# EAGLE schematic Maya - Leonardo 32U4 sch v36 (EAGLE 9.7.0)
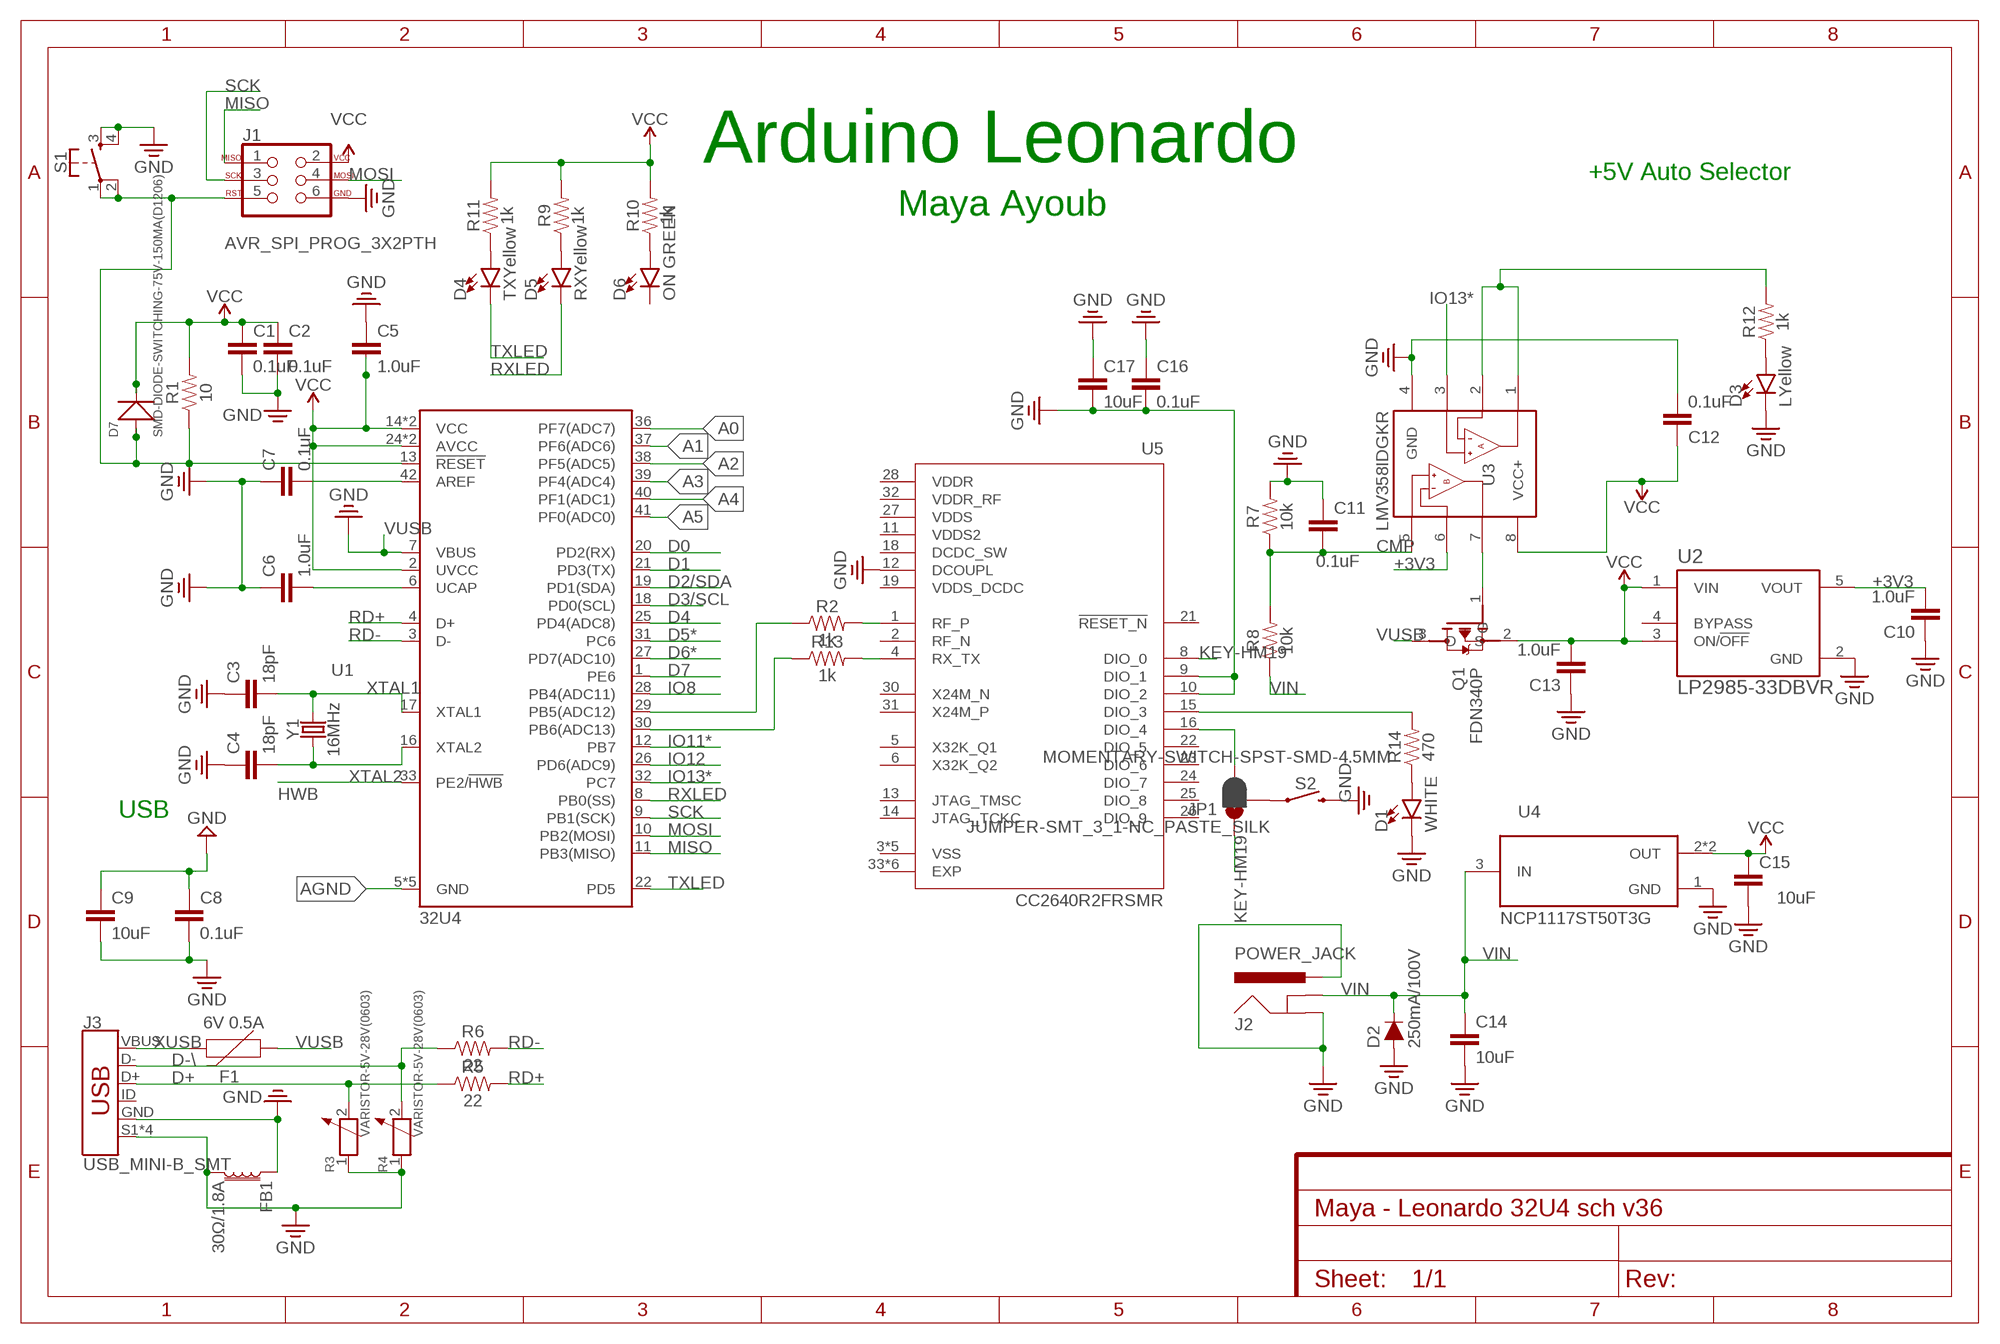
[diagram p0: schematic, sheet 1]

## Parts
C1  0.1uF  0.1UF-0603-25V-(+80/-20%)  [0603]
C2  0.1uF  0.1UF-0603-25V-(+80/-20%)  [0603]
C3  18pF  18PF-0603-50V-5%  [0603]
C4  18pF  18PF-0603-50V-5%  [0603]
C5  1.0uF  1.0UF-0805-25V-10%  [0805]
C6  1.0uF  1.0UF-0805-25V-(+80/-20%)  [0805]
C7  0.1uF  0.1UF-0603-25V-(+80/-20%)  [0603]
C8  0.1uF  0.1UF-0603-25V-(+80/-20%)  [0603]
C9  10uF  10UF-0603-6.3V-20%  [0603]
C10  1.0uF  1.0UF-0603-16V-10%  [0603]
C11  0.1uF  0.1UF-0603-25V-(+80/-20%)  [0603]
C12  0.1uF  0.1UF-0603-25V-(+80/-20%)  [0603]
C13  1.0uF  1.0UF-0603-16V-10%  [0603]
C14  10uF  10UF-0603-6.3V-20%  [0603]
C15  10uF  10UF-0603-6.3V-20%  [0603]
C16  0.1uF  0.1UF-0603-25V-(+80/-20%)  [0603]
C17  10uF  10UF-0603-6.3V-20%  [0603]
D1  WHITE  LED-WHITE0603  [LED-0603]
D2  250mA/100V  DIODE-BAS16J  [SOD-323]
D3  LYellow  LED-YELLOW0603  [LED-0603]
D4  TXYellow  LED-YELLOW0603  [LED-0603]
D5  RXYellow  LED-YELLOW0603  [LED-0603]
D6  ON GREEN  LED-GREEN0603  [LED-0603]
D7  SMD-DIODE-SWITCHING-75V-150MA(D1206)  [LED-1206]
F1  6V 0.5A  PPTC_6V500MA  [0805]
FB1  30Ω/1.8A  FERRITE_BEAD-0603  [0603]
J1  AVR_SPI_PROG_3X2PTH  [2X3]
J2  POWER_JACK  [POWER_JACK_PTH]
J3  USB_MINI-B_SMT  [USB-MINIB]
JP1  JUMPER-SMT_3_1-NC_PASTE_SILK  [SMT-JUMPER_3_1-NC_PASTE_SILK]
Q1  FDN340P  [SOT95P240X120-3N]
R1  10  10OHM-0603-1/10W-5%  [0603]
R2  1k  1KOHM-0603-1/10W-1%  [0603]
R3  VARISTOR-5V-28V(0603)  SMD-RES-VARISTOR-5V-28V(0603)  [R0603]
R4  VARISTOR-5V-28V(0603)  SMD-RES-VARISTOR-5V-28V(0603)  [R0603]
R5  22  22OHM-0603-1/10W-1%  [0603]
R6  22  22OHM-0603-1/10W-1%  [0603]
R7  10k  10KOHM-0603-1/10W-1%  [0603]
R8  10k  10KOHM-0603-1/10W-1%  [0603]
R9  1k  1KOHM-0603-1/10W-1%  [0603]
R10  1k  1KOHM-0603-1/10W-1%  [0603]
R11  1k  1KOHM-0603-1/10W-1%  [0603]
R12  1k  1KOHM-0603-1/10W-1%  [0603]
R13  1k  1KOHM-0603-1/10W-1%  [0603]
R14  470  470OHM-0603-1/10W-1%  [0603]
S1  MOMENTARY-SWITCH-SPST-2-SMD-5.2MM  [TACTILE_SWITCH_SMD_5.2MM]
S2  MOMENTARY-SWITCH-SPST-SMD-4.5MM  [TACTILE_SWITCH_SMD_4.5MM]
U1  32U4  ATMEGA32U4TQFP-44  [TQFP44]
U2  LP2985-33DBVR  [SOT95P280X145-5N]
U3  LMV358IDGKR  [SOP65P490X110-8N]
U4  NCP1117ST50T3G  [SOT230P700X180-4N]
U5  CC2640R2FRSMR  [QFN40P400X400X100-33N]
Y1  16MHz  CRYSTAL-16MHZSMD-5X3.2  [CRYSTAL-SMD-5X3.2-4PAD]

## Nets
+3V3: C10.2 U2.5(VOUT) U3.6(2IN-)
+5V: C15.1 U4.2(OUT) U4.4(OUT) ; supply symbol labelled VCC
A0: U1.36(PF7(ADC7))
A1: U1.37(PF6(ADC6))
A2: U1.38(PF5(ADC5))
A3: U1.39(PF4(ADC4))
A4: U1.40(PF1(ADC1))
A5: U1.41(PF0(ADC0))
AGND: U1.5(GND) U1.15(GND) U1.23(GND) U1.35(GND) U1.43(GND)
CMP: C11.2 R7.1 R8.2 U3.5(2IN+)
D0: U1.20(PD2(RX))
D1: U1.21(PD3(TX))
D2/SDA: U1.19(PD1(SDA))
D3/SCL: U1.18(PD0(SCL))
D4: U1.25(PD4(ADC8))
D5*: U1.31(PC6)
D6*: U1.27(PD7(ADC10))
D7: U1.1(PE6)
D9/RX: R2.1 U1.29(PB5(ADC12))
D10/TX: R13.1 U1.30(PB6(ADC13))
D+: J3.D+ R5.1
D-\: J3.D- R4.2 R6.1
GND: C1.2 C2.2 C3.1 C4.1 C5.1 C6.1 C7.1 C8.1 C8.2 C9.1 C9.2 C10.1 C11.1 C12.2 C13.1 C14.2 C15.2 C16.1 C16.2 C17.1 C17.2 D1.C D2.A D3.C FB1.1 FB1.2 J1.6 J2.GND J2.PWR J3.GND J3.S1(SHIELD) J3.S2(SHIELD) J3.S3(SHIELD) J3.S4(SHIELD) R3.1 R4.1 R7.2 S1.3 S1.4 S2.1 S2.4 U2.2(GND) U3.4(GND) U4.1(GND) U5.9(DIO_1) U5.10(DIO_2) U5.12(DCOUPL)
HWB: U1.33(PE2/!HWB)
IO8: U1.28(PB4(ADC11))
IO11*: U1.12(PB7)
IO12: U1.26(PD6(ADC9))
IO13*: U1.32(PC7) U3.3(1IN+)
KEY-HM19: JP1.1 U5.8(DIO_0)
MISO: J1.1 U1.11(PB3(MISO))
MOSI: J1.4 U1.10(PB2(MOSI))
N$1: R3.2
N$2: D7.+ J1.5 R1.1 S1.1 S1.2 U1.13(!RESET)
N$3: R12.2 U3.1(1OUT) U3.2(1IN-)
N$4: Q1.1(G) U3.7(2OUT)
N$5: C7.2 U1.42(AREF)
N$6: C6.2 U1.6(UCAP)
N$7: R2.2 U5.1(RF_P)
N$9: D3.A R12.1
N$10: D4.A R11.1
N$11: D5.A R9.1
N$12: D6.A R10.1
N$13: JP1.2 S2.2 S2.3
N$14: R13.2 U5.4(RX_TX)
N$15: R14.2 U5.15(DIO_3)
N$16: JP1.3 U5.16(DIO_4)
N$17: D1.A R14.1
RD+: R5.2 U1.4(D+)
RD-: R6.2 U1.3(D-)
RXLED: D5.C U1.8(PB0(SS))
SCK: J1.3 U1.9(PB1(SCK))
TXLED: D4.C U1.22(PD5)
VCC: C1.1 C2.1 C5.2 C12.1 C13.2 D7.- J1.2 Q1.2(S) R1.2 R9.2 R10.2 R11.2 U1.2(UVCC) U1.14(VCC) U1.24(AVCC) U1.34(VCC) U1.44(AVCC) U2.1(VIN) U2.3(ON/!OFF) U3.8(VCC+)
VIN: C14.1 D2.C J2.GNDBREAK R8.1 U4.3(IN)
VUSB: F1.1 Q1.3(D) U1.7(VBUS) ; supply symbol labelled GND
XTAL1: C3.2 U1.17(XTAL1) Y1.3
XTAL2: C4.2 U1.16(XTAL2) Y1.1
XUSB: F1.2 J3.VBUS
Unconnected: D6.C J3.ID U2.4(BYPASS) U5.2(RF_N) U5.5(X32K_Q1) U5.6(X32K_Q2) U5.13(JTAG_TMSC) U5.14(JTAG_TCKC) U5.21(!RESET_N) U5.22(DIO_5) U5.23(DIO_6) U5.24(DIO_7) U5.25(DIO_8) U5.26(DIO_9) U5.30(X24M_N) U5.31(X24M_P)

## Notes on the sheet
- Arduino Leonardo
- +5V Auto Selector
- Maya Ayoub
- USB

## Power pins joined to a net without a drawn wire
DCDC_SW: U5.18(DCDC_SW)
EXP: U5.33(EXP) U5.33_1(EXP) U5.33_2(EXP) U5.33_3(EXP) U5.33_4(EXP) U5.33_5(EXP)
VDDR: U5.28(VDDR)
VDDR_RF: U5.32(VDDR_RF)
VDDS: U5.27(VDDS)
VDDS2: U5.11(VDDS2)
VDDS_DCDC: U5.19(VDDS_DCDC)
VSS: U5.3(VSS) U5.7(VSS) U5.17(VSS) U5.20(VSS) U5.29(VSS)

## Library data of the parts
C1 C2 C7 C8 C11 C12 C16 = SparkFun-Capacitors:0.1UF: 0.1µF ceramic capacitors A capacitor is a passive two-terminal electrical component used to store electrical energy temporarily in an electric field.; PROD_ID: CAP-00810
C3 C4 = SparkFun-Capacitors:18PF: 18pF ceramic capacitors A capacitor is a passive two-terminal electrical component used to store electrical energy temporarily in an electric field.; PROD_ID: CAP-08267
C5 = SparkFun-Capacitors:1.0UF: 1µF ceramic capacitors A capacitor is a passive two-terminal electrical component used to store electrical energy temporarily in an electric field.; PROD_ID: CAP-08064
C6 = SparkFun-Capacitors:1.0UF: 1µF ceramic capacitors A capacitor is a passive two-terminal electrical component used to store electrical energy temporarily in an electric field.; PROD_ID: CAP-11625
C9 C14 C15 C17 = SparkFun-Capacitors:10UF: 10.0µF ceramic capacitors A capacitor is a passive two-terminal electrical component used to store electrical energy temporarily in an electric field.; PROD_ID: CAP-11015
C10 C13 = SparkFun-Capacitors:1.0UF: 1µF ceramic capacitors A capacitor is a passive two-terminal electrical component used to store electrical energy temporarily in an electric field.; PROD_ID: CAP-00868
D1 = SparkFun-LED:LED-WHITE: White SMD LED Used in manufacturing several products at SparkFun. Packages: 0603 - Bright White SMD 0603 package[Product Link] <http://www.kingbrightusa.com/product.asp?catalog_name=LED&product_id=APT1608QWF/D> 1206 - Bright White SMD1206 package [Product Link] <http://www.kingbrightusa.com/product.asp?catalog_name=LED&product_id=APT3216QWF/D> 3014 - Super Bright SMD 3014 package [Datasheet] <http://www.lumileds.com/uploads/459/DS208-pdf> SparkFun Products: Blackberry Trackballer Breakout <https://www.sparkfun.com/products/13169> Digital SandBox <https://www.sparkfun.com/products/12651>; PROD_ID: DIO-09004
D2 = SparkFun-DiscreteSemi:DIODE: Diode These are standard reverse protection diodes and small signal diodes. SparkFun Products: SparkFun SparkPunk Sound Kit <https://www.sparkfun.com/products/11177> SparkFun ESP8266 Thing <https://www.sparkfun.com/products/13231>; PROD_ID: DIO-09646
D3-D5 = SparkFun-LED:LED-YELLOW: Yellow SMD LED Used in manufacturing several products at SparkFun. Packages: 0603 - SMD 0603 package[Product Link] <http://www.kingbrightusa.com/product.asp?catalog_name=LED&product_id=APT1608SYCK> 0603 -SMART - SMART SMD 0603 package (more efficient/more expensive) [Product Link] <http://www.osram-os.com/osram_os/en/products/product-catalog/led-light-emitting-diodes/smartled-0603/ly-l29k/index.jsp> LilyPad - SMD1206 package[Product Datasheet] <https://www.sparkfun.com/datasheets/DevTools/LilyPad/Q150YUS4.pdf> SparkFun Products: Blynk Board <https://www.sparkfun.com/products/13794> IOIO-OTG <https://www.sparkfun.com/products/13613> XBee Explorer Serial <https://www.sparkfun.com/products/13225>; PROD_ID: DIO-09003; VALUE: Yellow
D6 = SparkFun-LED:LED-GREEN: Green SMD LED Used in manufacturing of various products at SparkFun Packages: 0603 - SMD 0603 package [Product Link] <http://www.futureelectronics.com/en/technologies/semiconductors/optoelectronics/leds/Pages/9894312-LTST-C190GKT.aspx?CrossPart=HSMG-C190&IM=0> LilyPad 1206 - SMD1206 LilyPad package [Product Link] <http://www.futureelectronics.com/en/Technologies/Product.aspx?ProductID=IN150NGHARVATEKCORPORATION2049943&IM=0> 1206 - SMD1206 package [Product Link] <http://www.futureelectronics.com/en/technologies/semiconductors/optoelectronics/leds/Pages/8315665-LTST-C150KGKT.aspx?IM=0> 1206 Bottom Mount -SMD 1206 Bottom Mount [Product Link] <http://www.digikey.com/product-detail/en/lite-on-inc/LTST-C230KGKT/160-1456-1-ND/386854> SparkFun Products: Pro Mini 328 -5V <https://www.sparkfun.com/products/821> RedBoard <https://www.sparkfun.com/products/12757> MP3 Trigger <https://www.sparkfun.com/products/13720> Makey Makey <https://www.sparkfun.com/products/11076>; PROD_ID: DIO-00821; VALUE: GREEN
D7 = SMD-DIODE-SWITCHING-75V-150MA_D1206_:SMD-DIODE-SWITCHING-75V-150MA(D1206): 304040005 Check prices <https://pricing.snapeda.com/parts/CD1206-S01575/Bourns/view-part?ref=eda>; AVAILABILITY: Warning; DESCRIPTION: Diode Standard 100V 150mA Surface Mount 1206; MF: Bourns; MP: CD1206-S01575; PACKAGE: 1206 Bourns; PRICE: None
F1 = SparkFun-Fuses:PPTC: Resettable Fuse PPTC Resettable Fuse. Really a sort of resistor with a polymeric positive temperature coefficient whose resistance increases dramatically with an increase in temperature. When heated by the power passing through the resistance rises causing the current to be limited, protecting the circuit. This is achieved by the transition of the polymer from a crystalline to an amorphous state where the conductive carbon separates breaking the conductive pathways found in the cool crystalline structure. When a PPTC cools back down it resumes conducting letting the circuit turn back on. SparkFun Products: SparkFun RedBoard - Programmed with Arduino <https://www.sparkfun.com/products/12757> Pro Micro - 5V/16MHz <https://www.sparkfun.com/products/12640> Arduino Pro 328 - 5V/16MHz <https://www.sparkfun.com/products/10915> MP3 Trigger <https://www.sparkfun.com/products/13720>; PROD_ID: RES-13945
FB1 = SparkFun-Coils:FERRITE_BEAD: Ferrite Bead (blocks, cores, rings, chokes, etc.) Inductor with layers of ferrite used to suppress high frequencies. Often used to isolate high frequency noise. SparkFun Products: IOIO-OTG - V2.2 <https://www.sparkfun.com/products/13613> SparkFun SAMD21 Mini Breakout <https://www.sparkfun.com/products/13664> SparkFun 6 Degrees of Freedom Breakout - LSM6DS3 <https://www.sparkfun.com/products/13339> SparkFun SAMD21 Dev Breakout <https://www.sparkfun.com/products/13672>; PROD_ID: NDUC-13805
J1 = SparkFun-Connectors:AVR_SPI_PROG_3X2: AVR ISP 6 Pin This is the reduced ISP connector for AVR programming. Common on Arduino. This footprint will take up less PCB space and can be used with a 10-pin to 6-pin adapter such as SKU: BOB-08508 **Special note about "TEST_POINT" package. The stop mask is on the top side, so if you want your programming test points to be on the bottom of your board, make sure to place this package on the bottom side of the board. This also ensure that the orientation to program from the bottom side will be correct. SparkFun Products: SparkFun ISP Pogo Adapter <https://www.sparkfun.com/products/11591> - NS Tiny AVR Programmer <https://www.sparkfun.com/products/11801> -PTH
J2 = SparkFun-Connectors:POWER_JACK: Power Jack Connector This is the standard 5.5mm barrel jack for power. The PTH is the most common, proven, reliable, footprint. The Slot footprint only works if the mill layer is transmitted to the PCB fab house so be warned. Here are the connectors we sell at SparkFun: DC Barrel Power Jack/Connector <https://www.sparkfun.com/products/119> (PRT-00119) DC Barrel Power Jack/Connector (SMD) <https://www.sparkfun.com/products/12748> (PRT-12748) DC Barrel Jack Adapter - Breadboard Compatible <https://www.sparkfun.com/products/10811> (PRT-10811) It is used on this SparkFun product (and many, many others): SparkFun RedBoard - Programmed with Arduino <https://www.sparkfun.com/products/12757> (DEV-12757) Also, if you need a mating power supply or connector, please check these out: Wall Adapter Power Supply - 9VDC 650mA <https://www.sparkfun.com/products/298> (TOL-00298) DC Barrel Jack Adapter - Male <https://www.sparkfun.com/products/10287> (PRT-10287); PROD_ID: CONN-08197
J3 = SparkFun-Connectors:USB_MINI-B: USB type Mini-B Connector Breaks out 5th pin, and includes shield pins if needed. SparkFun Products: SparkFun FTDI Basic Breakout <https://www.sparkfun.com/products/9716> SparkFun XBee Explorer USB <https://www.sparkfun.com/products/11812> SparkFun Redboard <https://www.sparkfun.com/products/12757>; PROD_ID: CONN-08193; SF_ID: PRT-00587
JP1 = SparkFun-Jumpers:JUMPER-SMT_3_1-NC_PASTE: Normally closed solder jumper (1 of 2 connections) This jumper has an aperture in the stencil to allow solder paste to bridge one of the two connections. One connection is normally closed (NC), while the other is normally open (NO). Wick off the solder to open the connection. Reapply solder to reclose the connection. Apply solder to the other side instead to change the current path.
Q1 = FDN340P:FDN340P: FDN340P Series 20V 70 mOhm Single P-Ch Logic Level PowerTrench Mosfet SSOT-3 Check prices <https://pricing.snapeda.com/parts/FDN340P/ON%20Semiconductor/view-part?ref=eda>; AVAILABILITY: Good; DESCRIPTION: P-Channel 20V 2A (Ta) 500mW (Ta) Surface Mount SuperSOT-3; MF: ON Semiconductor; MP: FDN340P; PACKAGE: None; PRICE: None; PURCHASE-URL: https://pricing.snapeda.com/search/part/FDN340P/?ref=eda
R1 = SparkFun-Resistors:10OHM: 10Ω resistor A resistor is a passive two-terminal electrical component that implements electrical resistance as a circuit element. Resistors act to reduce current flow, and, at the same time, act to lower voltage levels within circuits. - Wikipedia; PROD_ID: RES-09834
R2 R9-R13 = SparkFun-Resistors:1KOHM: 1kΩ resistor A resistor is a passive two-terminal electrical component that implements electrical resistance as a circuit element. Resistors act to reduce current flow, and, at the same time, act to lower voltage levels within circuits. - Wikipedia; PROD_ID: RES-07856
R3 R4 = SMD-RES-VARISTOR-5V-28V_0603_:SMD-RES-VARISTOR-5V-28V(0603): 314130003 Check prices <https://pricing.snapeda.com/parts/CG0603MLC-05E/Bourns/view-part?ref=eda>; AVAILABILITY: Good; DESCRIPTION: Varistor 1 Circuit Surface Mount, MLCV 0603 (1608 Metric); MF: Bourns; MP: CG0603MLC-05E; PACKAGE: 0603 Bourns Inc.; PRICE: None; PURCHASE-URL: https://pricing.snapeda.com/search/part/CG0603MLC-05E/?ref=eda
R5 R6 = SparkFun-Resistors:22OHM: 22Ω resistor A resistor is a passive two-terminal electrical component that implements electrical resistance as a circuit element. Resistors act to reduce current flow, and, at the same time, act to lower voltage levels within circuits. - Wikipedia; PROD_ID: RES-08698
R7 R8 = SparkFun-Resistors:10KOHM: 10kΩ resistor A resistor is a passive two-terminal electrical component that implements electrical resistance as a circuit element. Resistors act to reduce current flow, and, at the same time, act to lower voltage levels within circuits. - Wikipedia; PROD_ID: RES-00824
R14 = SparkFun-Resistors:470OHM: 470Ω resistor A resistor is a passive two-terminal electrical component that implements electrical resistance as a circuit element. Resistors act to reduce current flow, and, at the same time, act to lower voltage levels within circuits. - Wikipedia; PROD_ID: RES-07869
S1 = SparkFun-Switches:MOMENTARY-SWITCH-SPST-2: Momentary Switch (Pushbutton) - SPST - Two Circuits Normally-open (NO) SPST momentary switches (buttons, pushbuttons). Schematic symbol includes two switch circuits. Variants SMD-4.6MMX2.8MM - 4.60mm x 2.80mm Tactile Momentary Button Switch - Used on SparkFun SAMD21 Mini Breakout <https://www.sparkfun.com/products/13664> SMD-5.2MM - Mini Pushbutton Switch - SMD <https://www.sparkfun.com/products/8720> - Used on Arduino Pro Mini <https://www.sparkfun.com/products/11114>; PROD_ID: SWCH-08247; SF_SKU: COM-08720
S2 = SparkFun-Switches:MOMENTARY-SWITCH-SPST: Momentary Switch (Pushbutton) - SPST Normally-open (NO) SPST momentary switches (buttons, pushbuttons). Variants PTH-12MM - 12mm square, through-hole Momentary Pushbutton Switch - 12mm Square <https://www.sparkfun.com/products/9190> (COM-09190) PTH-6.0MM, PTH-6.0MM-KIT - 6.0mm square, through-hole Mini Pushbutton Switch <https://www.sparkfun.com/products/97> (COM-00097) KIT package intended for soldering kit's - only one side of pads' copper is exposed. PTH-RIGHT-ANGLE-KIT - Right-angle, through-hole Right Angle Tactile Button <https://www.sparkfun.com/products/10791> - Used on SparkFun BigTime Watch Kit <https://www.sparkfun.com/products/11734> SMD-12MM - 12mm square, surface-mount Tactile Button - SMD (12mm) <https://www.sparkfun.com/products/12993> (COM-12993) Used on SparkFun PicoBoard <https://www.sparkfun.com/products/11888> SMD-4.5MM - 4.5mm Square Trackball Switch Used on SparkFun Blackberry Trackballer Breakout <https://www.sparkfun.com/products/13169> SMD-4.6MMX2.8MM - 4.60mm x 2.80mm, surface mount Used on SparkFun SAMD21 Mini Breakout <https://www.sparkfun.com/products/13664> SMD-5.2MM, SMD-5.2-REDUNDANT - 5.2mm square, surface-mount Mini Pushbutton Switch - SMD <https://www.sparkfun.com/products/8720> (COM-08720) Used on Arduino Pro Mini <https://www.sparkfun.com/products/11114> REDUNDANT package connects both switch circuits together SMD-6.0X3.5MM - 6.0 x 3.5mm, surface mount Momentary Reset Switch SMD <https://www.sparkfun.com/products/8229> (COM-08229) SMD-6.2MM-TALL - 6.2mm square, surface mount Tactile Button - SMD (6mm) <https://www.sparkfun.com/products/12992> Used on SparkFun Digital Sandbox <https://www.sparkfun.com/products/12651> SMD-RIGHT-ANGLE - Right-angle, surface mount Used on SparkFun Block for Intel® Edison - Arduino <https://www.sparkfun.com/products/13036>; PROD_ID: SWCH-09213
U1 = SparkFun-IC-Microcontroller:ATMEGA32U4: Atmel MCU, 32KByte Atmel 44-pin 8-bit Microcontroller with 32KBytes of ISP Flash and USB Controller Datasheet <http://cdn.sparkfun.com/datasheets/Dev/Arduino/Boards/ATMega32U4.pdf> SparkFun Products LilyPad Arduino USB - ATmega32U4 Board <https://www.sparkfun.com/products/12049> (DEV-12049) Pro Micro - 5V/16MHz <https://www.sparkfun.com/products/12640> (DEV-12640) Pro Micro - 3.3V/8MHz <https://www.sparkfun.com/products/12587> (DEV-12587) Fio v3 - ATmega32U4 <https://www.sparkfun.com/products/11520> (DEV-11520) Qduino Mini <https://www.sparkfun.com/products/13614> (DEV-13614) Makey Makey - Standard Kit <https://www.sparkfun.com/products/11511> (WIG-11511) Makey Makey Deluxe Kit <https://www.sparkfun.com/products/11519> (WIG-11519); PROD_ID: IC-11161
U2 = LP2985-33DBVR:LP2985-33DBVR: 150-mA, 16-V, low-dropout voltage regulator with enable 5-SOT-23 -40 to 125 Check prices <https://pricing.snapeda.com/parts/LP2985-33DBVR/Texas%20Instruments/view-part?ref=eda>; AVAILABILITY: Warning; DESCRIPTION: 150-mA, 16-V, low-dropout voltage regulator with enable 5-SOT-23 -40 to 125; MF: Texas Instruments; MP: LP2985-33DBVR; PACKAGE: SOT-23-5 Texas Instruments; PRICE: None; PURCHASE-URL: https://pricing.snapeda.com/search/part/LP2985-33DBVR/?ref=eda
U3 = LMV358IDGKR:LMV358IDGKR: Dual Low-Voltage Rail-to-Rail Output Operational Amplifier - see LMV358A for upgraded version 8-VSSOP -40 to 125 Check prices <https://pricing.snapeda.com/parts/LMV358IDGKR/Texas%20Instruments/view-part?ref=eda>; AVAILABILITY: Good; DESCRIPTION: Dual Low-Voltage Rail-to-Rail Output Operational Amplifier - see LMV358A for upgraded version 8-VSSOP -40 to 125; MF: Texas Instruments; MP: LMV358IDGKR; PACKAGE: VSSOP-8 Texas Instruments; PRICE: None; PURCHASE-URL: https://pricing.snapeda.com/search/part/LMV358IDGKR/?ref=eda
U4 = NCP1117ST50T3G:NCP1117ST50T3G: 1.0 A Low-Dropout Positive ,Fixed and Adjustable,Voltage Regulators Check prices <https://pricing.snapeda.com/parts/NCP1117ST50T3G/ON%20Semiconductor/view-part?ref=eda>; AVAILABILITY: Warning; DESCRIPTION: Linear Voltage Regulator IC Positive Fixed 1 Output 1A SOT-223; MF: ON Semiconductor; MP: NCP1117ST50T3G; PACKAGE: SOT-223-4 ON Semiconductor; PRICE: None; PURCHASE-URL: https://pricing.snapeda.com/search/part/NCP1117ST50T3G/?ref=eda
U5 = CC2640R2FRSMR:CC2640R2FRSMR: SimpleLink™ Bluetooth® low energy Wireless MCU 32-VQFN -40 to 85; MANUFACTURER: Texas Instruments; MAXIMUM_PACKAGE_HEIGHT: 1mm; STANDARD: IPC 7351B
Y1 = SparkFun-Clocks:CRYSTAL-16MHZ: 16MHz Crystal Digikey Example <http://www.digikey.com/product-search/en?keywords=535-9122-1-ND> Frequency: 16MHz Frequency Stability: ±50ppm Frequency Tolerance: ±20ppm Load Capacitance: 18pF SparkFun Products: Pro Micro -5V/16MHz <https://www.sparkfun.com/products/12640> SparkFun Serial Enabled LCD Kit <https://www.sparkfun.com/products/10097>; PROD_ID: XTAL-08218; SF_ID: COM-00094